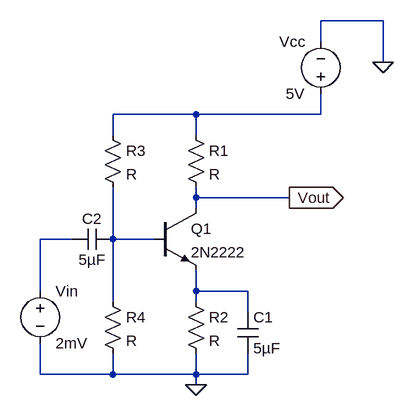
[diagram p0: schematic Q2.asc]
Q2.asc, the LTspice schematic file:
Version 4
SHEET 1 880 680
WIRE 592 -160 496 -160
WIRE 496 -128 496 -160
WIRE 592 -96 592 -160
WIRE 304 -16 176 -16
WIRE 496 -16 496 -48
WIRE 496 -16 304 -16
WIRE 176 16 176 -16
WIRE 304 16 304 -16
WIRE 304 112 304 96
WIRE 448 112 304 112
WIRE 304 128 304 112
WIRE 112 176 64 176
WIRE 176 176 176 96
WIRE 240 176 176 176
WIRE 64 256 64 176
WIRE 304 256 304 224
WIRE 384 256 304 256
WIRE 176 272 176 176
WIRE 304 272 304 256
WIRE 384 288 384 256
WIRE 64 384 64 336
WIRE 176 384 176 352
WIRE 176 384 64 384
WIRE 304 384 304 352
WIRE 304 384 176 384
WIRE 384 384 384 352
WIRE 384 384 304 384
WIRE 304 400 304 384
FLAG 304 400 0
FLAG 592 -96 0
FLAG 448 112 Vout
IOPIN 448 112 Out
SYMBOL npn 240 128 R0
SYMATTR InstName Q1
SYMATTR Value 2N2222
SYMBOL res 288 0 R0
SYMATTR InstName R1
SYMBOL res 288 256 R0
SYMATTR InstName R2
SYMBOL res 160 0 R0
SYMATTR InstName R3
SYMBOL res 160 256 R0
SYMATTR InstName R4
SYMBOL voltage 64 240 R0
WINDOW 123 0 0 Left 0
WINDOW 39 0 0 Left 0
SYMATTR InstName Vin
SYMATTR Value 2mV
SYMBOL cap 368 288 R0
SYMATTR InstName C1
SYMATTR Value 5µF
SYMBOL cap 176 160 R90
WINDOW 0 0 32 VBottom 2
WINDOW 3 32 32 VTop 2
SYMATTR InstName C2
SYMATTR Value 5µF
SYMBOL voltage 496 -32 R180
WINDOW 0 24 96 Left 2
WINDOW 3 24 16 Left 2
WINDOW 123 0 0 Left 0
WINDOW 39 0 0 Left 0
SYMATTR InstName Vcc
SYMATTR Value 5V

The netlist it stands for:
* Q2.asc
Q1 Vout N003 N004 0 2N2222
R1 N001 Vout R
R2 N004 0 R
R3 N001 N003 R
R4 N003 0 R
Vin N002 0 2mV
C1 N004 0 5µF
C2 N003 N002 5µF
Vcc N001 0 5V
.model NPN NPN
.model PNP PNP
.lib standard.bjt
.backanno
.end